# Altium schematic sheet sdsheet.SchDoc
size A4
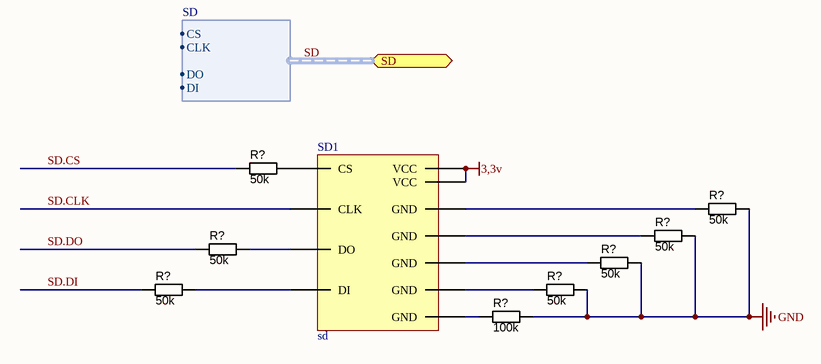
[diagram p0: sdsheet.SchDoc]

## Parts
(Parts that share a designator on the sheet are numbered #1, #2 ... from top to bottom, then left to right.)
R?#1  value 50k  [RESC3216N_ZERO]  (hidden comment: Thick Film)
R?#2  value 50k  [RESC3216N_ZERO]  (hidden comment: Thick Film)
R?#3  value 50k  [RESC3216N_ZERO]  (hidden comment: Thick Film)
R?#4  value 50k  [RESC3216N_ZERO]  (hidden comment: Thick Film)
R?#5  value 50k  [RESC3216N_ZERO]  (hidden comment: Thick Film)
R?#6  value 50k  [RESC3216N_ZERO]  (hidden comment: Thick Film)
R?#7  value 50k  [RESC3216N_ZERO]  (hidden comment: Thick Film)
R?#8  value 100k  [RESC3216N_ZERO]  (hidden comment: Thick Film)
SD1  sd  [Edge Connector - duplicate1]

## Ports
SD (harness SD)

## Harnesses
SD: CS, CLK, DO, DI

## Nets
3,3v: SD1.4(VCC) SD1.11(VCC)
GND: R?#2.1 R?#3.1 R?#5.1 R?#7.1 R?#8.1
SD.CLK: SD1.5(CLK)
SD.CS: R?#1.2
SD.DI: R?#6.2
SD.DO: R?#4.2
NetR?#1_1: R?#1.1 SD1.1(CS)
NetR?#2_2: R?#2.2 SD1.3(GND)
NetR?#3_2: R?#3.2 SD1.6(GND)
NetR?#4_1: R?#4.1 SD1.7(DO)
NetR?#5_2: R?#5.2 SD1.8(GND)
NetR?#6_1: R?#6.1 SD1.2(DI)
NetR?#7_2: R?#7.2 SD1.10(GND)
NetR?#8_2: R?#8.2 SD1.12(GND)

## Buses and harness runs
harness SD = port SD

## Library data of the parts
R?#1-R?#5 R?#7 = RES_0R_1206: Resistor SMD chip 50k Ohm 0.25W 1206; Manufacturer 1: Vishay/Dale; Manufacturer Part Number 1: CRCW12060000Z0EA; Tolerance: ±5%; Ratings: 1/4W; Package / Case: 1206 (3216 metric); Supplier 1: Digi-Key; Supplier Part Number 1: 541-0.0ECT-ND
R?#6 = RES_0R_1206: Resistor SMD chip 50k Ohm 0.25W 1206; Manufacturer 1: Vishay/Dale; Manufacturer Part Number 1: CRCW12060000Z0EA; Tolerance: ±0,1%; Ratings: 0,4W; Package / Case: 1206 (3216 metric); Supplier 1: Digi-Key; Supplier Part Number 1: 541-0.0ECT-ND
R?#8 = RES_0R_1206: Resistor SMD chip 100k Ohm 0.25W 1206; Manufacturer 1: Vishay/Dale; Manufacturer Part Number 1: CRCW12060000Z0EA; Tolerance: ±5%; Ratings: 1/4W; Package / Case: 1206 (3216 metric); Supplier 1: Digi-Key; Supplier Part Number 1: 541-0.0ECT-ND